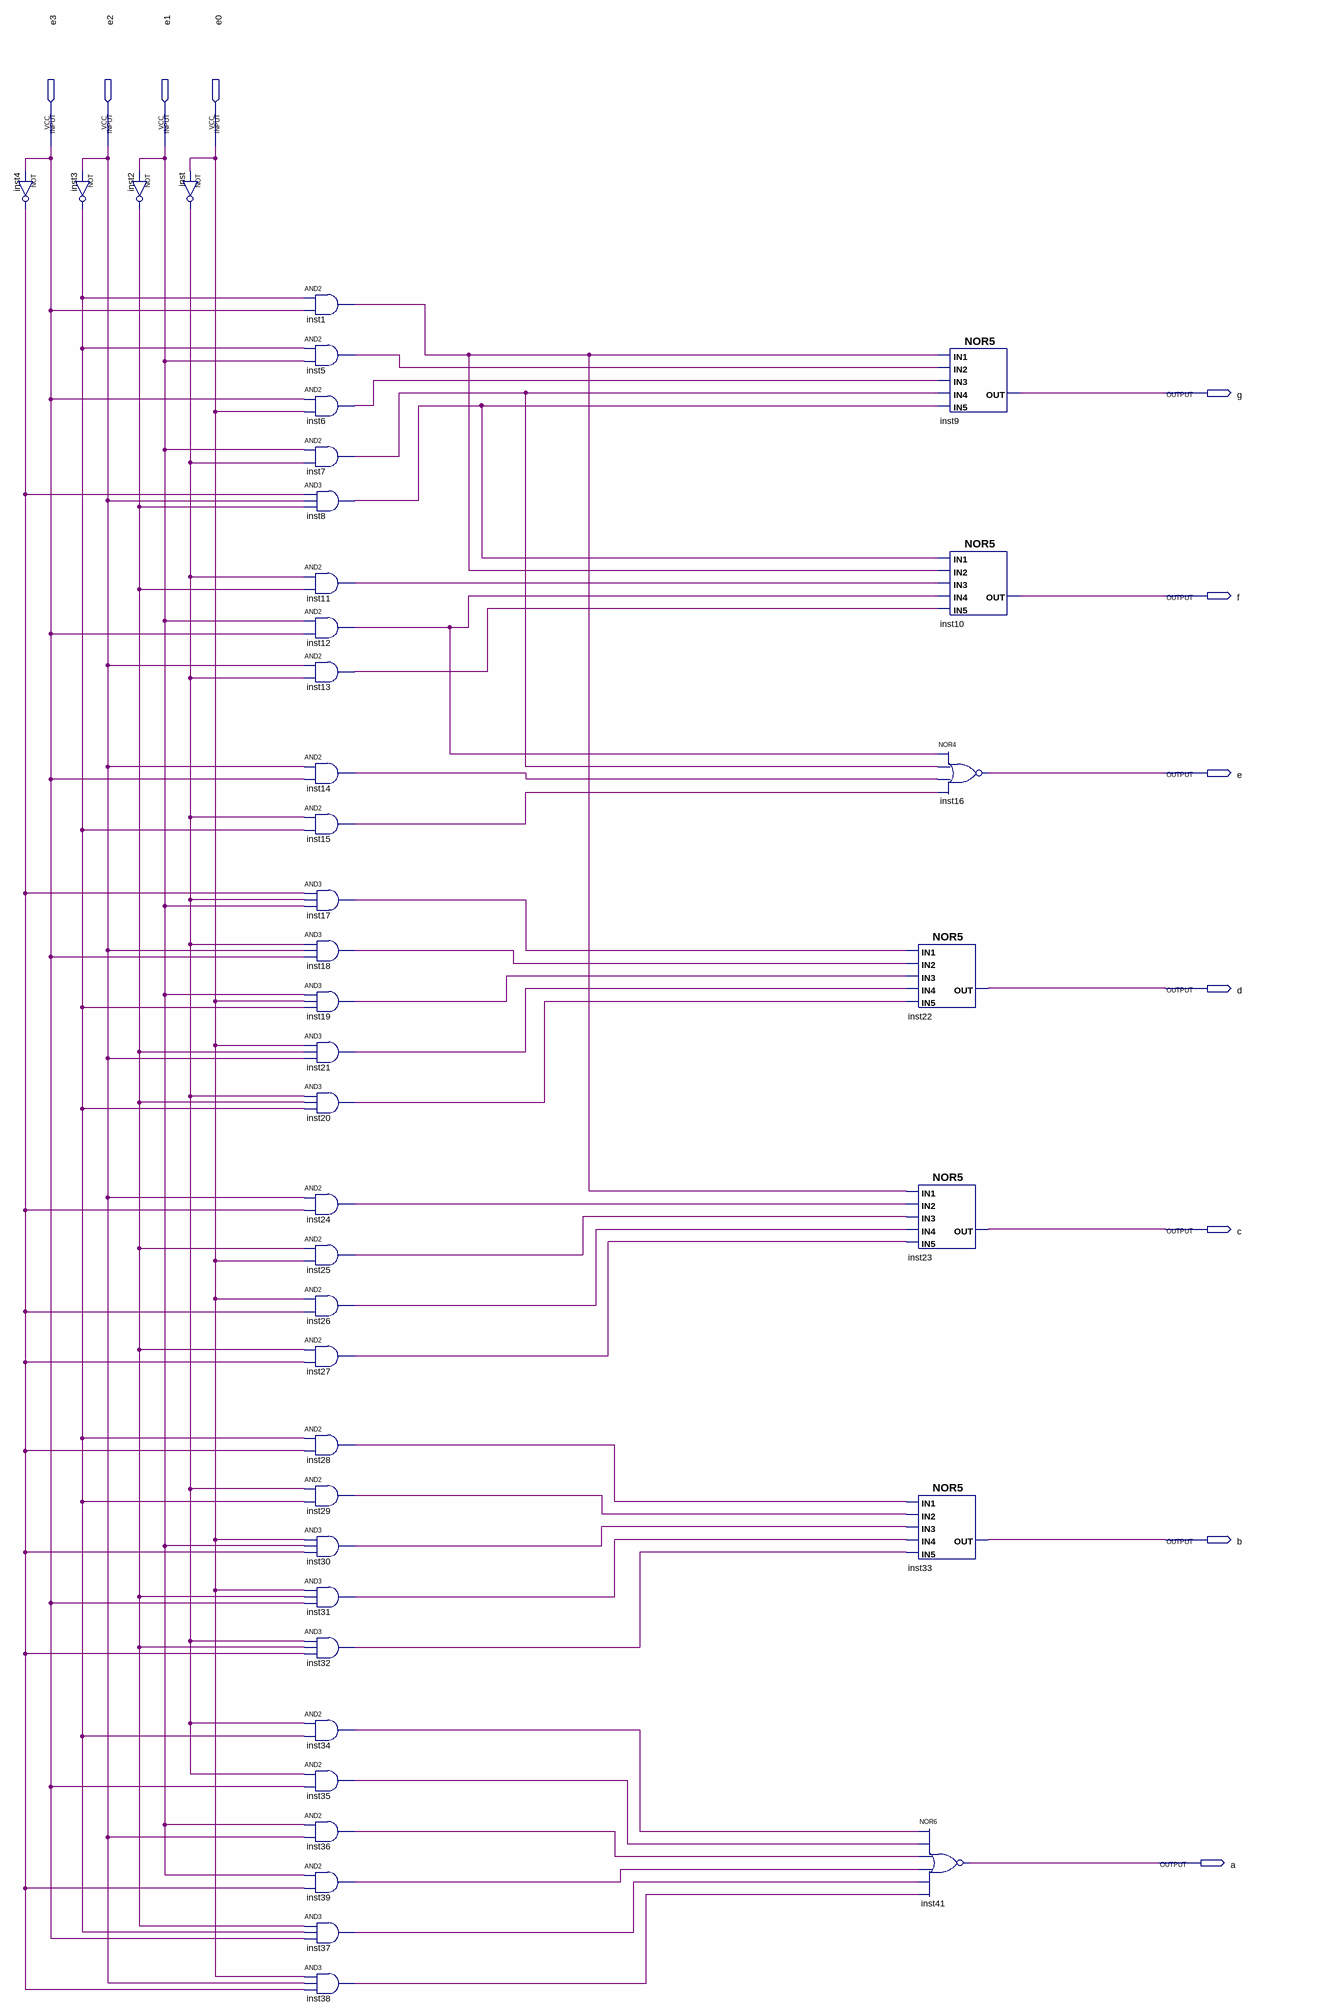
[diagram p0: schematic sheet]
// Quartus schematic display_7_sec.bdf as structural Verilog: 41 symbols, 11 pins
module display_7_sec (
  input  e3,
  input  e2,
  input  e1,
  input  e0,
  output g,
  output f,
  output e,
  output d,
  output c,
  output b,
  output a
);

  wire inst1_out, inst2_out, inst3_out, inst4_out, inst5_out, inst6_out, inst7_out, inst8_out, inst11_out,
       inst12_out, inst13_out, inst14_out, inst15_out, inst17_out, inst18_out, inst19_out, inst20_out,
       inst21_out, inst24_out, inst25_out, inst26_out, inst27_out, inst28_out, inst29_out, inst30_out,
       inst31_out, inst32_out, inst34_out, inst35_out, inst36_out, inst37_out, inst38_out, inst39_out,
       inst_out;

  not inst4 (inst4_out, e3);
  not inst3 (inst3_out, e2);
  not inst2 (inst2_out, e1);
  not inst (inst_out, e0);
  and inst1 (inst1_out, inst3_out, e3);
  and inst5 (inst5_out, inst3_out, e1);
  and inst6 (inst6_out, e3, e0);
  and inst7 (inst7_out, e1, inst_out);
  and inst8 (inst8_out, inst4_out, e2, inst2_out);
  and inst11 (inst11_out, inst_out, inst2_out);
  and inst12 (inst12_out, e1, e3);
  and inst13 (inst13_out, e2, inst_out);
  and inst14 (inst14_out, e2, e3);
  and inst15 (inst15_out, inst_out, inst3_out);
  and inst17 (inst17_out, inst4_out, inst_out, e1);
  and inst18 (inst18_out, inst_out, e2, e3);
  and inst19 (inst19_out, e1, e0, inst3_out);
  and inst21 (inst21_out, e0, inst2_out, e2);
  and inst20 (inst20_out, inst_out, inst2_out, inst3_out);
  and inst24 (inst24_out, e2, inst4_out);
  and inst25 (inst25_out, inst2_out, e0);
  and inst26 (inst26_out, e0, inst4_out);
  and inst27 (inst27_out, inst2_out, inst4_out);
  and inst28 (inst28_out, inst3_out, inst4_out);
  and inst29 (inst29_out, inst_out, inst3_out);
  and inst30 (inst30_out, e0, e1, inst4_out);
  and inst31 (inst31_out, e0, inst2_out, e3);
  and inst32 (inst32_out, inst_out, inst2_out, inst4_out);
  and inst34 (inst34_out, inst_out, inst3_out);
  and inst35 (inst35_out, inst_out, e3);
  and inst36 (inst36_out, e1, e2);
  and inst39 (inst39_out, e1, inst4_out);
  and inst37 (inst37_out, inst2_out, inst3_out, e3);
  and inst38 (inst38_out, e0, e2, inst4_out);
  nor inst9 (g, inst1_out, inst5_out, inst6_out, inst7_out, inst8_out);
  nor inst10 (f, inst8_out, inst1_out, inst11_out, inst12_out, inst13_out);
  nor inst16 (e, inst12_out, inst7_out, inst14_out, inst15_out);
  nor inst22 (d, inst17_out, inst18_out, inst19_out, inst21_out, inst20_out);
  nor inst23 (c, inst1_out, inst24_out, inst25_out, inst26_out, inst27_out);
  nor inst33 (b, inst28_out, inst29_out, inst30_out, inst31_out, inst32_out);
  nor inst41 (a, inst34_out, inst35_out, inst36_out, inst39_out, inst37_out, inst38_out);
endmodule
